# Altium schematic sheet FPGA.SCHDOC
size B
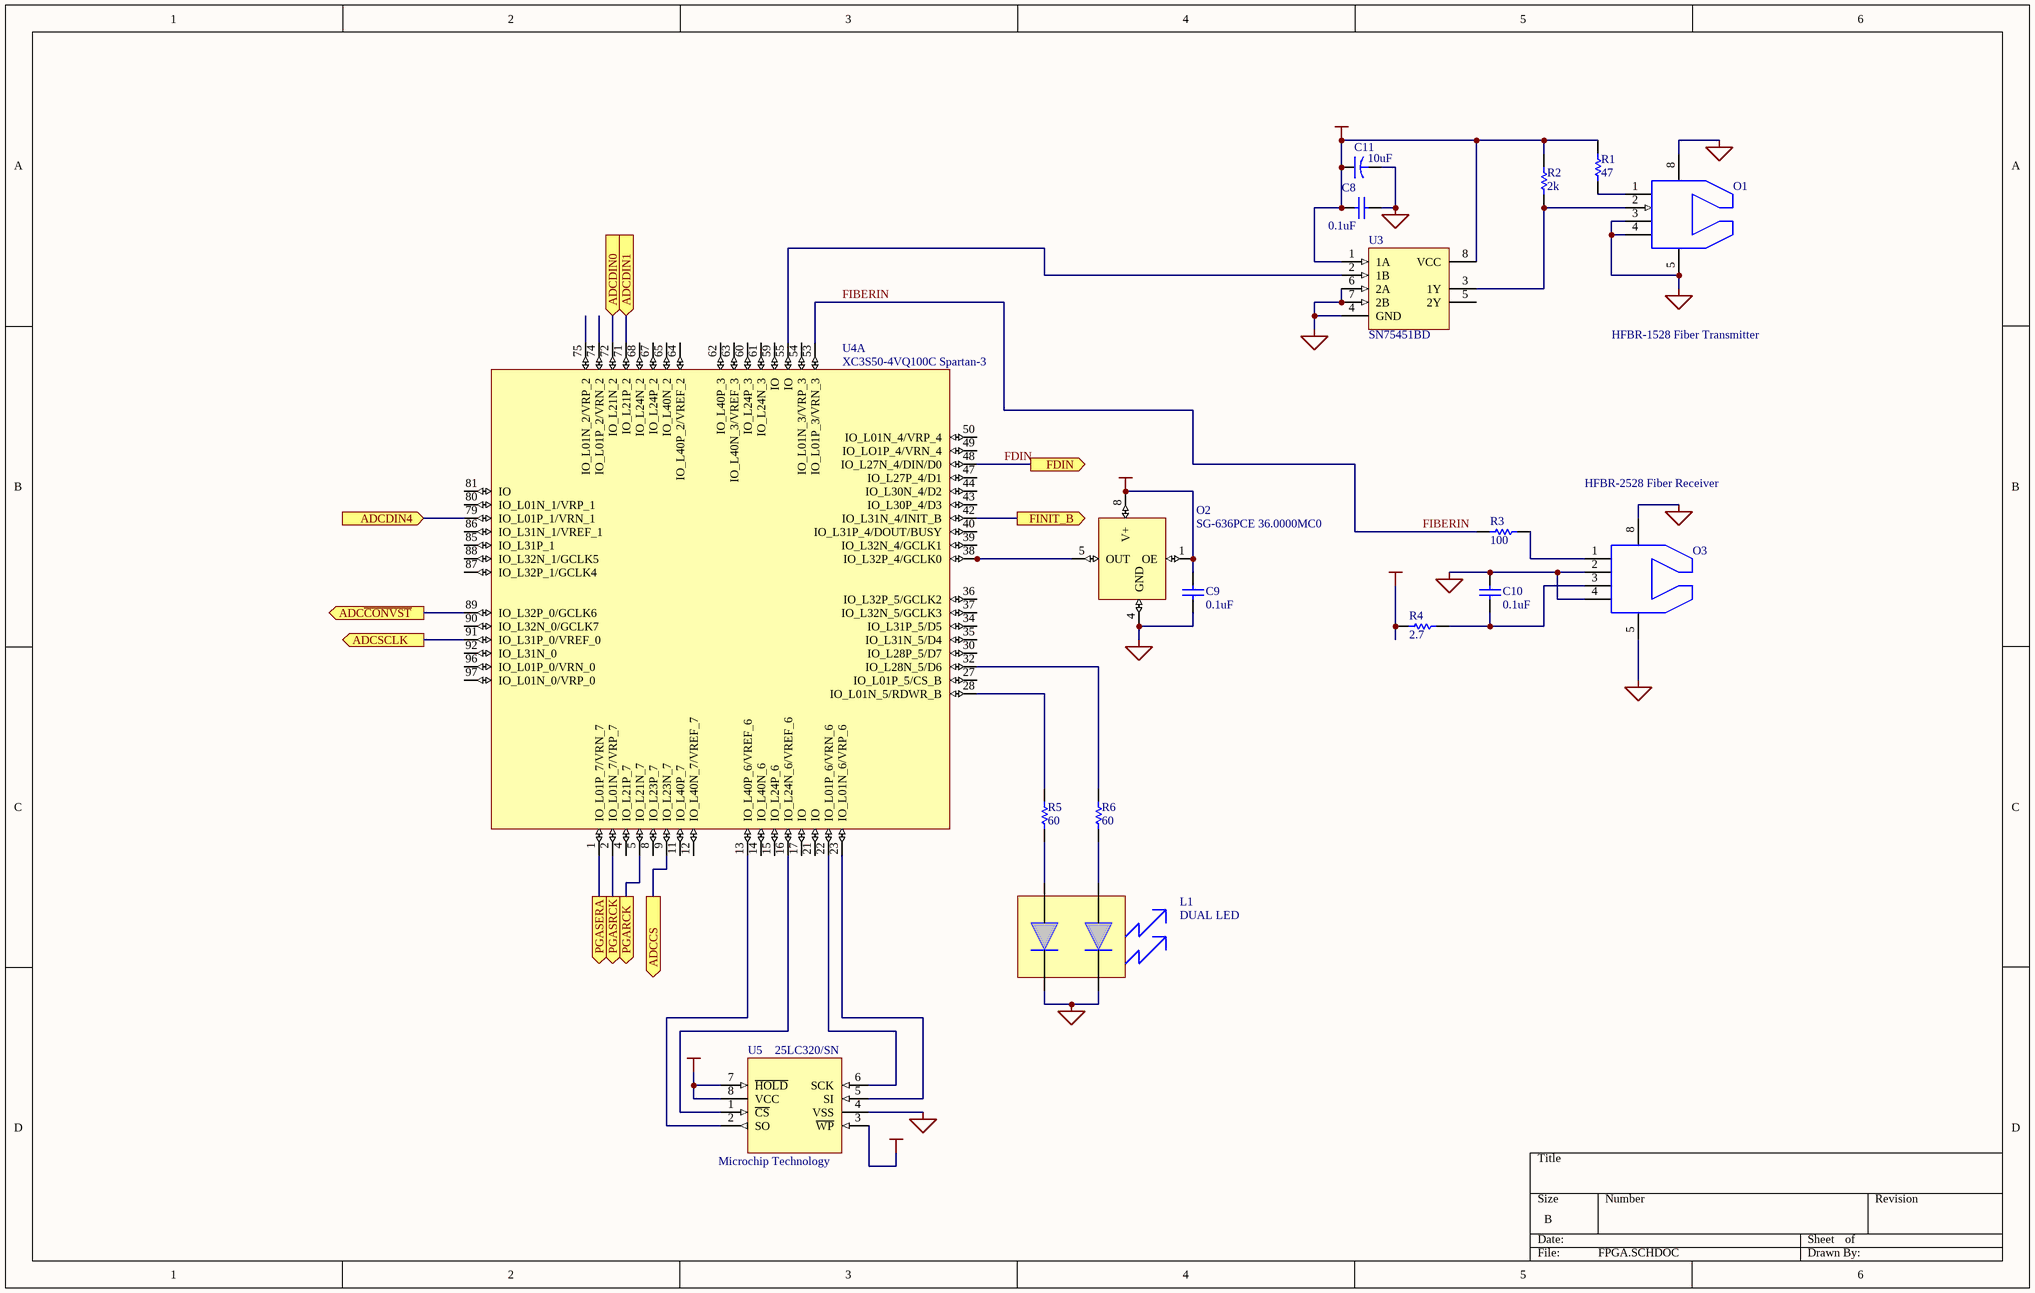
[diagram p0: FPGA.SCHDOC]

## Parts
C8  value 0.1uF  [CC1608-0603]  (hidden comment: Cap)
C9  value 0.1uF  [CC1608-0603]  (hidden comment: Cap)
C10  value 0.1uF  [CC1608-0603]  (hidden comment: Cap)
C11  value 10uF  [TC3528-1411]
L1  DUAL LED  [LUMEX DUAL RT-ANG LED]
O1  HFBR-1528 Fiber Transmitter  [HPVL]
O2  SG-636PCE 36.0000MC0  [SG636PCE]
O3  HFBR-2528 Fiber Receiver  [HPVL]
R1  value 47  [CC1608-0603]  (hidden comment: Res1)
R2  value 2k  [CC1608-0603]  (hidden comment: Res1)
R3  value 100  [CC1608-0603]  (hidden comment: Res1)
R4  value 2.7  [CC1608-0603]  (hidden comment: Res1)
R5  value 60  [CC1608-0603]  (hidden comment: Res1)
R6  value 60  [CC1608-0603]  (hidden comment: Res1)
U3  SN75451BD  [SO-G8/E2.5]
U4  XC3S50-4VQ100C Spartan-3  [F-QFP14X14-G100/N]  (part A of 2)
U5  25LC320/SN  Vendor: Microchip Technology  [SO-G8/E2.9]

## Ports
ADCCS (out), ADCDIN0 (in), ADCDIN1 (in), ADCDIN4 (in), ADCSCLK (out), ADC~{CONVST} (out), FDIN (out), FINIT_B (out), PGARCK (out), PGASERA (out), PGASRCK (out)

## Nets
+5VCC: C8.1 C11.1 R1.2 R2.2 R4.1 U3.1(1A) U3.8(VCC)
GND: C8.2 C9.2 C10.2 C11.2 L1.2 L1.4(C2) O1.3 O1.4 O1.5 O1.8 O2.4(GND) O3.2 O3.4 O3.5 O3.8 U3.4(GND) U3.6(2A) U3.7(2B) U5.4(VSS)
VCC: C9.1 O2.1(OE) O2.8(V+) U5.3(~{WP}) U5.7(~{HOLD}) U5.8(VCC)
ADC~{CONVST}: U4.89(IO_L32P_0/GCLK6) ; port ADC~{CONVST}
ADCCS: U4.9(IO_L23N_7) ; port ADCCS
ADCDIN0: U4.72(IO_L21N_2) ; port ADCDIN0
ADCDIN1: U4.71(IO_L21P_2) ; port ADCDIN1
ADCDIN4: U4.79(IO_L01P_1/VRN_1) ; port ADCDIN4
ADCSCLK: U4.91(IO_L31P_0/VREF_0) ; port ADCSCLK
FDIN: U4.48(IO_L27N_4/DIN/D0) ; port FDIN
FIBERIN: R3.1 U4.53(IO_L01P_3/VRN_3)
FINIT_B: U4.42(IO_L31N_4/INIT_B) ; port FINIT_B
PGARCK: U4.5(IO_L21N_7) ; port PGARCK
PGASERA: U4.1(IO_L01P_7/VRN_7) ; port PGASERA
PGASRCK: U4.2(IO_L01N_7/VRP_7) ; port PGASRCK
NetC10_1: C10.1 O3.3 R4.2
NetL1_1: L1.1(A1) R5.2
NetL1_3: L1.3(A2) R6.2
NetO1_1: O1.1 R1.1
NetO1_2: O1.2 R2.1 U3.3(1Y)
NetO2_5: O2.5(OUT) U4.38(IO_L32P_4/GCLK0)
NetO3_1: O3.1 R3.2
NetR5_1: R5.1 U4.28(IO_L01N_5/RDWR_B)
NetR6_1: R6.1 U4.32(IO_L28N_5/D6)
NetU3_2: U3.2(1B) U4.55(IO)
NetU4_13: U4.13(IO_L40P_6/VREF_6) U5.2(SO)
NetU4_16: U4.16(IO_L24N_6/VREF_6) U5.1(~{CS})
NetU4_22: U4.22(IO_L01P_6/VRN_6) U5.6(SCK)
NetU4_23: U4.23(IO_L01N_6/VRP_6) U5.5(SI)

Not connected (* = marked no-connect by the designer): U3 5(2Y); U4 4(IO_L21P_7) 8(IO_L23P_7) 11(IO_L40P_7) 12(IO_L40N_7/VREF_7) 14(IO_L40N_6) 15(IO_L24P_6) 17(IO) 21(IO) 27(IO_L01P_5/CS_B) 30(IO_L28P_5/D7) 34(IO_L31P_5/D5) 35(IO_L31N_5/D4) 36(IO_L32P_5/GCLK2) 37(IO_L32N_5/GCLK3) 39(IO_L32N_4/GCLK1) 40(IO_L31P_4/DOUT/BUSY) 43(IO_L30P_4/D3) 44(IO_L30N_4/D2) 47(IO_L27P_4/D1) 49(IO_LO1P_4/VRN_4) 50(IO_L01N_4/VRP_4) 54(IO_L01N_3/VRP_3) 59(IO) 60(IO_L24P_3) 61(IO_L24N_3) 62(IO_L40P_3) 63(IO_L40N_3/VREF_3) 64(IO_L40P_2/VREF_2) 65(IO_L40N_2) 67(IO_L24P_2) 68(IO_L24N_2) 74(IO_L01P_2/VRN_2) 75(IO_L01N_2/VRP_2) 80(IO_L01N_1/VRP_1) 81(IO) 85(IO_L31P_1) 86(IO_L31N_1/VREF_1) 87(IO_L32P_1/GCLK4) 88(IO_L32N_1/GCLK5) 90(IO_L32N_0/GCLK7) 92(IO_L31N_0) 96(IO_L01P_0/VRN_0) 97(IO_L01N_0/VRP_0)

## Library data of the parts
C8-C10 = Cap: Capacitor; Manufacturer: Generic Components; Class I: Passive; Published: 8-Jun-2000; Revision: July-2002: Re-released for DXP Platform.; Publisher: Altium Limited; Class II: Capacitor
C11 = Cap2: Capacitor; Manufacturer: Generic Components; Class I: Passive; Published: 23-Sep-2002; Publisher: Altium Limited; Class II: Capacitor
O1 = HFBR-1528: Low-cost fiber transmitter; Vendor: Agilent
O2 = SG-636PCE: Epson CMOS/TTL Oscillator; Vendor: Epson Electronics America Inc
O3 = HFBR-2528: Low-cost fiber receiver; Vendor: Agilent
R1-R6 = Res1: Resistor; Manufacturer: Generic Components; Class I: Passive; Published: 8-Jun-2000; Revision: July-2002: Re-released for DXP Platform.; Publisher: Altium Limited; Class II: Resistor
U3 = SN75451BD: Dual Peripheral Driver; Manufacturer: Texas Instruments; Package Information: Latest Revision: Jan-1998; Class I: Interface; Published: 15-May-2002; Datasheet: 1991 Interface Circuits Data Book (May-1990); Package Reference: D008; Publisher: Altium Limited; Class II: Peripheral Driver
U4 = XC3S50-4VQ100C: Xilinx Spartan-3 VQ100; Vendor: Xilinx
U5 = 25LC320-SOIC: 32k SPI Bus Serial EEPROM